# EAGLE schematic Sch1 (EAGLE 7.7.0)
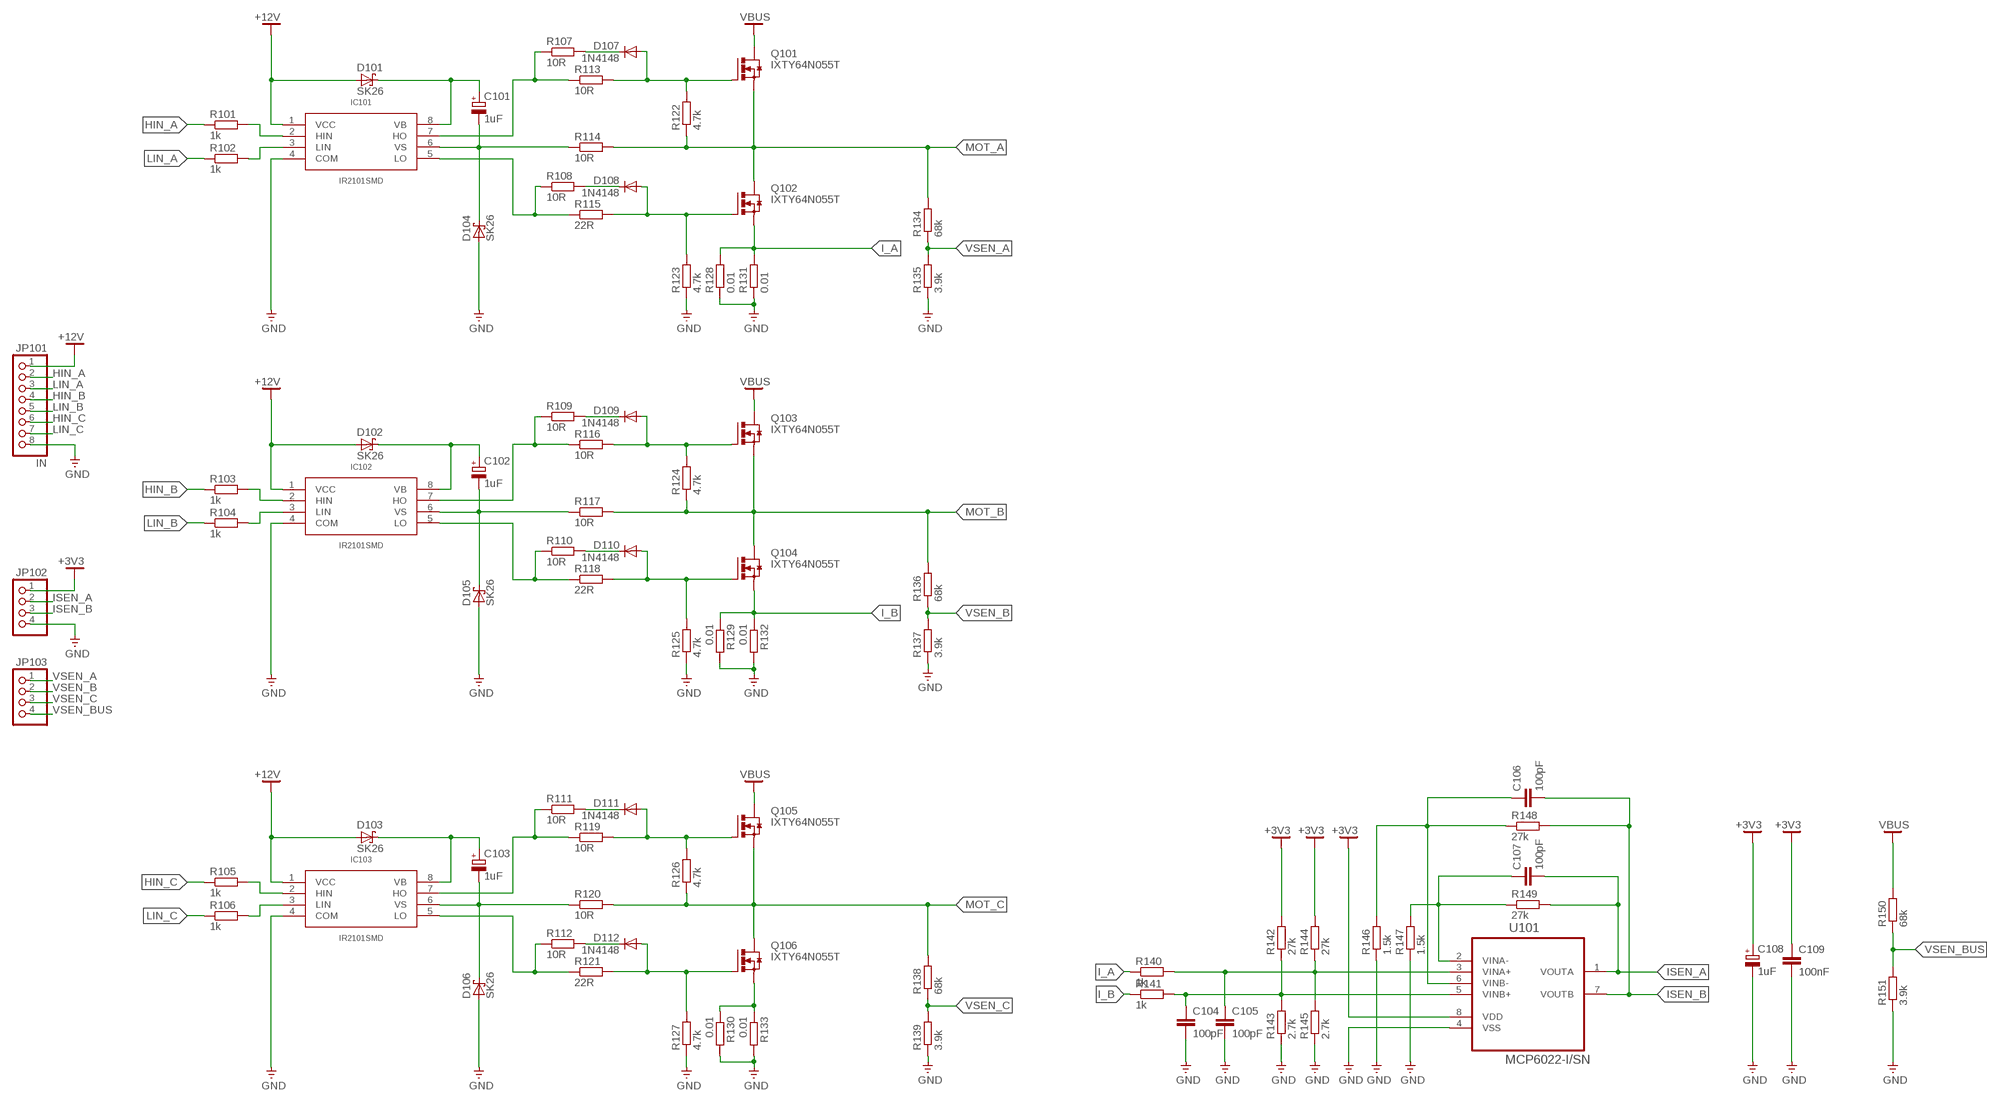
[diagram p0: schematic, sheet 1]

## Parts
C101  1uF  CPOL-EUSMCA  [SMC_A]
C102  1uF  CPOL-EUSMCA  [SMC_A]
C103  1uF  CPOL-EUSMCA  [SMC_A]
C104  100pF  C-EUC0805  [C0805]
C105  100pF  C-EUC0805  [C0805]
C106  100pF  C-EUC0805  [C0805]
C107  100pF  C-EUC0805  [C0805]
C108  1uF  CPOL-EUSMCA  [SMC_A]
C109  100nF  C-EUC1206  [C1206]
D101  SK26  SCHOTTKY-DIODEDO214AA  [DO214AA]
D102  SK26  SCHOTTKY-DIODEDO214AA  [DO214AA]
D103  SK26  SCHOTTKY-DIODEDO214AA  [DO214AA]
D104  SK26  SCHOTTKY-DIODEDO214AA  [DO214AA]
D105  SK26  SCHOTTKY-DIODEDO214AA  [DO214AA]
D106  SK26  SCHOTTKY-DIODEDO214AA  [DO214AA]
D107  1N4148  1N4148SOD123  [SOD123FL]
D108  1N4148  1N4148SOD123  [SOD123FL]
D109  1N4148  1N4148SOD123  [SOD123FL]
D110  1N4148  1N4148SOD123  [SOD123FL]
D111  1N4148  1N4148SOD123  [SOD123FL]
D112  1N4148  1N4148SOD123  [SOD123FL]
IC101  IR2101SMD  [SOIC-8]
IC102  IR2101SMD  [SOIC-8]
IC103  IR2101SMD  [SOIC-8]
JP101  IN  PINHD-1X8  [1X08]
JP102  PINHD-1X4  [1X04]
JP103  PINHD-1X4  [1X04]
Q101  IXTY64N055T  [TO252]
Q102  IXTY64N055T  [TO252]
Q103  IXTY64N055T  [TO252]
Q104  IXTY64N055T  [TO252]
Q105  IXTY64N055T  [TO252]
Q106  IXTY64N055T  [TO252]
R101  1k  R-EU_R0805  [R0805]
R102  1k  R-EU_R0805  [R0805]
R103  1k  R-EU_R0805  [R0805]
R104  1k  R-EU_R0805  [R0805]
R105  1k  R-EU_R0805  [R0805]
R106  1k  R-EU_R0805  [R0805]
R107  10R  R-EU_R0805  [R0805]
R108  10R  R-EU_R0805  [R0805]
R109  10R  R-EU_R0805  [R0805]
R110  10R  R-EU_R0805  [R0805]
R111  10R  R-EU_R0805  [R0805]
R112  10R  R-EU_R0805  [R0805]
R113  10R  R-EU_R0805  [R0805]
R114  10R  R-EU_R0805  [R0805]
R115  22R  R-EU_R0805  [R0805]
R116  10R  R-EU_R0805  [R0805]
R117  10R  R-EU_R0805  [R0805]
R118  22R  R-EU_R0805  [R0805]
R119  10R  R-EU_R0805  [R0805]
R120  10R  R-EU_R0805  [R0805]
R121  22R  R-EU_R0805  [R0805]
R122  4.7k  R-EU_R0805  [R0805]
R123  4.7k  R-EU_R0805  [R0805]
R124  4.7k  R-EU_R0805  [R0805]
R125  4.7k  R-EU_R0805  [R0805]
R126  4.7k  R-EU_R0805  [R0805]
R127  4.7k  R-EU_R0805  [R0805]
R128  0.01  R-EU_R2512  [R2512]
R129  0.01  R-EU_R2512  [R2512]
R130  0.01  R-EU_R2512  [R2512]
R131  0.01  R-EU_R2512  [R2512]
R132  0.01  R-EU_R2512  [R2512]
R133  0.01  R-EU_R2512  [R2512]
R134  68k  R-EU_R0805  [R0805]
R135  3.9k  R-EU_R0805  [R0805]
R136  68k  R-EU_R0805  [R0805]
R137  3.9k  R-EU_R0805  [R0805]
R138  68k  R-EU_R0805  [R0805]
R139  3.9k  R-EU_R0805  [R0805]
R140  1k  R-EU_R0805  [R0805]
R141  1k  R-EU_R0805  [R0805]
R142  27k  R-EU_R0805  [R0805]
R143  2.7k  R-EU_R0805  [R0805]
R144  27k  R-EU_R0805  [R0805]
R145  2.7k  R-EU_R0805  [R0805]
R146  1.5k  R-EU_R0805  [R0805]
R147  1.5k  R-EU_R0805  [R0805]
R148  27k  R-EU_R0805  [R0805]
R149  27k  R-EU_R0805  [R0805]
R150  68k  R-EU_R0805  [R0805]
R151  3.9k  R-EU_R0805  [R0805]
U101  MCP6022-I/SN  [SOIC127P600X175-8N]

## Nets
+3V3: C108.+ C109.1 JP102.1 R142.2 R144.2 U101.8(VDD)
+12V: D101.A D102.A D103.A IC101.1(VCC) IC102.1(VCC) IC103.1(VCC) JP101.1
GND: C104.2 C105.2 C108.- C109.2 D104.A D105.A D106.A IC101.4(COM) IC102.4(COM) IC103.4(COM) JP101.8 JP102.4 R123.1 R125.1 R127.1 R128.1 R129.2 R130.2 R131.1 R132.2 R133.2 R135.1 R137.1 R139.1 R143.1 R145.1 R146.1 R147.1 R151.1 U101.4(VSS)
HIN_A: JP101.2 R101.1
HIN_B: JP101.4 R103.1
HIN_C: JP101.6 R105.1
I_A: Q102.2(S) R128.2 R131.2 R140.1
I_B: Q104.2(S) R129.1 R132.1 R141.1
ISEN_A: C107.2 JP102.2 R149.2 U101.1(VOUTA)
ISEN_B: C106.2 JP102.3 R148.2 U101.7(VOUTB)
LIN_A: JP101.3 R102.1
LIN_B: JP101.5 R104.1
LIN_C: JP101.7 R106.1
MOT_A: Q101.2(S) Q102.3(D) R114.2 R122.1 R134.2
MOT_B: Q103.2(S) Q104.3(D) R117.2 R124.1 R136.2
MOT_C: Q105.2(S) Q106.3(D) R120.2 R126.1 R138.2
N$1: IC101.5(LO) R108.1 R115.1
N$2: IC101.3(LIN) R102.2
N$3: IC101.7(HO) R107.1 R113.1
N$4: D107.A Q101.1(G) R113.2 R122.2
N$5: D108.A Q102.1(G) R115.2 R123.2
N$6: C101.+ D101.C IC101.8(VB)
N$7: IC101.2(HIN) R101.2
N$8: D108.C R108.2
N$9: C105.1 R140.2 R144.1 R145.2 U101.3(VINA+)
N$10: C104.1 R141.2 R142.1 R143.2 U101.5(VINB+)
N$11: C106.1 R146.2 R148.1 U101.6(VINB-)
N$13: D107.C R107.2
N$14: Q106.2(S) R130.1 R133.1
N$16: D109.A Q103.1(G) R116.2 R124.2
N$17: D110.A Q104.1(G) R118.2 R125.2
N$18: IC102.5(LO) R110.1 R118.1
N$19: C102.+ D102.C IC102.8(VB)
N$20: C101.- D104.C IC101.6(VS) R114.1
N$21: IC102.3(LIN) R104.2
N$22: IC102.2(HIN) R103.2
N$23: C102.- D105.C IC102.6(VS) R117.1
N$25: IC102.7(HO) R109.1 R116.1
N$26: D110.C R110.2
N$27: D109.C R109.2
N$28: C107.1 R147.2 R149.1 U101.2(VINA-)
N$31: D111.A Q105.1(G) R119.2 R126.2
N$32: D112.A Q106.1(G) R121.2 R127.2
N$33: IC103.5(LO) R112.1 R121.1
N$34: C103.+ D103.C IC103.8(VB)
N$35: IC103.3(LIN) R106.2
N$36: IC103.2(HIN) R105.2
N$37: C103.- D106.C IC103.6(VS) R120.1
N$39: IC103.7(HO) R111.1 R119.1
N$40: D112.C R112.2
N$41: D111.C R111.2
VBUS: Q101.3(D) Q103.3(D) Q105.3(D) R150.2
VSEN_A: JP103.1 R134.1 R135.2
VSEN_B: JP103.2 R136.1 R137.2
VSEN_BUS: JP103.4 R150.1 R151.2
VSEN_C: JP103.3 R138.1 R139.2

## Library data of the parts
C101-C103 C108 = rcl:CPOL-EU: POLARIZED CAPACITOR, European symbol
C104-C107 C109 = rcl:C-EU: CAPACITOR, European symbol
D101-D106 = diode:SCHOTTKY-DIODE: Schottky Diode
D107-D112 = diode:1N4148: DIODE high speed (Philips)
IC101-IC103 = ir2101:IR2101
JP101 = pinhead:PINHD-1X8: PIN HEADER
JP102 JP103 = pinhead:PINHD-1X4: PIN HEADER
Q101-Q106 = tr:IXTY64N055T
R101-R106 R128-R151 = rcl:R-EU_: RESISTOR, European symbol
R107-R127 = resistor:R-EU_: RESISTOR, European symbol
U101 = Microchip_By_element14_Batch_1:MCP6022-I/SN: IC OPAMP 2.5V DUAL R-R; MPN: MCP6022-I/SN; OC_FARNELL: 1439415; OC_NEWARK: 59K0230; PACKAGE: 8SOIC; SUPPLIER: Microchip